# EAGLE design sch2 (EAGLE 7.6.0)
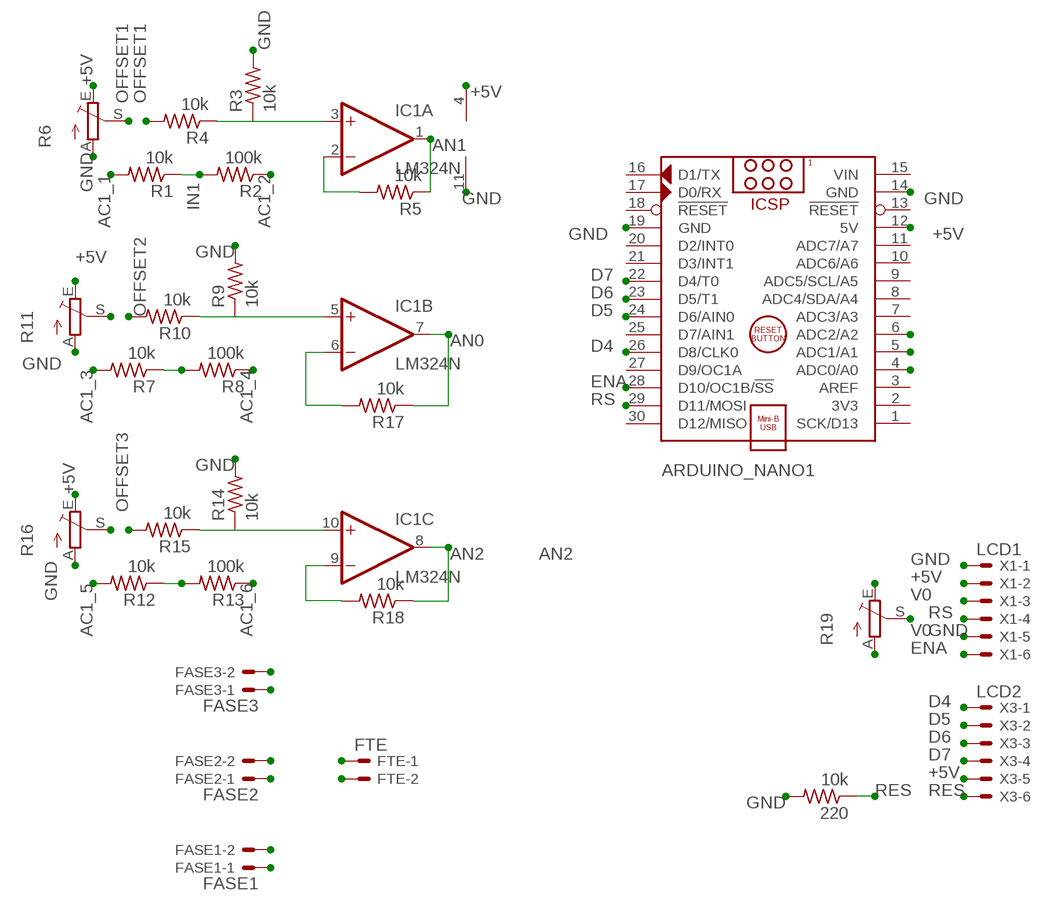
[diagram p0: schematic, sheet 1]

## Parts
220  10k  R-US_0204/7  [0204/7]
ARDUINO_NANO1  ARDUINO_NANO  [ARDUINO_NANO]
FASE1  FASE1  22-23-2021  [22-23-2021]
FASE2  FASE2  22-23-2021  [22-23-2021]
FASE3  FASE3  22-23-2021  [22-23-2021]
FTE  FTE  22-23-2021  [22-23-2021]
IC1  LM324N  [DIL14]
R1  10k  R-US_0204/7  [0204/7]
R2  100k  R-US_0204/7  [0204/7]
R3  10k  R-US_0204/7  [0204/7]
R4  10k  R-US_0204/7  [0204/7]
R5  10k  R-US_0204/7  [0204/7]
R6  TRIM_EU-B64Y  [B64Y]
R7  10k  R-US_0204/7  [0204/7]
R8  100k  R-US_0204/7  [0204/7]
R9  10k  R-US_0204/7  [0204/7]
R10  10k  R-US_0204/7  [0204/7]
R11  TRIM_EU-B64Y  [B64Y]
R12  10k  R-US_0204/7  [0204/7]
R13  100k  R-US_0204/7  [0204/7]
R14  10k  R-US_0204/7  [0204/7]
R15  10k  R-US_0204/7  [0204/7]
R16  TRIM_EU-B64Y  [B64Y]
R17  10k  R-US_0204/7  [0204/7]
R18  10k  R-US_0204/7  [0204/7]
R19  TRIM_EU-B64Y  [B64Y]
X1  LCD1  22-23-2061  [22-23-2061]
X3  LCD2  22-23-2061  [22-23-2061]

## Nets
+5V: ARDUINO_NANO1.12(5V) FTE.1 IC1.4(P:V+) R6.E R11.E R16.E R19.E X1.2 X3.5
AC1_1: FASE1.1 R1.2
AC1_2: FASE1.2 R2.1
AC1_3: FASE2.1 R7.2
AC1_4: FASE2.2 R8.1
AC1_5: FASE3.1 R12.2
AC1_6: FASE3.2 R13.1
AN0: ARDUINO_NANO1.4(ADC0/A0) IC1.7(B:OUT) R17.1
AN1: ARDUINO_NANO1.5(ADC1/A1) IC1.1(A:OUT) R5.1
AN2: ARDUINO_NANO1.6(ADC2/A2) IC1.8(C:OUT) R18.1
D4: ARDUINO_NANO1.26(D8/CLK0) X3.1
D5: ARDUINO_NANO1.24(D6/AIN0) X3.2
D6: ARDUINO_NANO1.23(D5/T1) X3.3
D7: ARDUINO_NANO1.22(D4/T0) X3.4
ENA: ARDUINO_NANO1.28(D10/OC1B/!SS) X1.6
GND: 220.2 ARDUINO_NANO1.14(GND) ARDUINO_NANO1.19(GND) FTE.2 IC1.11(P:V-) R3.2 R6.A R9.2 R11.A R14.2 R16.A R19.A X1.1 X1.5
IN1: IC1.3(A:+IN) R1.1 R2.2 R3.1 R4.1
IN2: IC1.5(B:+IN) R7.1 R8.2 R9.1 R10.1
IN3: IC1.10(C:+IN) R12.1 R13.2 R14.1 R15.1
N$1: IC1.9(C:-IN) R18.2
N$2: IC1.2(A:-IN) R5.2
N$5: IC1.6(B:-IN) R17.2
OFFSET1: R4.2 R6.S
OFFSET2: R10.2 R11.S
OFFSET3: R15.2 R16.S
RES: 220.1 X3.6
RS: ARDUINO_NANO1.29(D11/MOSI) X1.4
V0: R19.S X1.3
Unconnected: ARDUINO_NANO1.1(SCK/D13) ARDUINO_NANO1.2(3V3) ARDUINO_NANO1.3(AREF) ARDUINO_NANO1.7(ADC3/A3) ARDUINO_NANO1.8(ADC4/SDA/A4) ARDUINO_NANO1.9(ADC5/SCL/A5) ARDUINO_NANO1.10(ADC6/A6) ARDUINO_NANO1.11(ADC7/A7) ARDUINO_NANO1.13(!RESET) ARDUINO_NANO1.16(D1/TX) ARDUINO_NANO1.17(D0/RX) ARDUINO_NANO1.18(!RESET) ARDUINO_NANO1.20(D2/INT0) ARDUINO_NANO1.21(D3/INT1) ARDUINO_NANO1.25(D7/AIN1) ARDUINO_NANO1.27(D9/OC1A) ARDUINO_NANO1.30(D12/MISO) IC1.12(D:+IN) IC1.13(D:-IN) IC1.14(D:OUT)

## Power pins joined to a net without a drawn wire
VIN: ARDUINO_NANO1.15(VIN)

## Library data of the parts
220 R1-R5 R7-R10 R12-R15 R17 R18 = rcl:R-US_: RESISTOR, American symbol
ARDUINO_NANO1 = ArduinoNanoV30:ARDUINO_NANO: Arduino Nano V3.0 Module Overview: The Arduino Nano is a small, complete, and breadboard-friendly board based on the ATmega328 (Arduino Nano 3.x) or ATmega168 (Arduino Nano 2.x). It has more or less the same functionality of the Arduino Duemilanove, but in a different package. It lacks only a DC power jack, and works with a Mini-B USB cable instead of a standard one. The Nano was designed and is being produced by Gravitech <http://www.gravitech.us/arna30wiatp.html>. General specifications: Item Value Microcontroller Atmel ATmega168 or ATmega328 Operating Voltage (logic level) 5 V Input Voltage (recommended) 7-12 V Input Voltage (limits) 6-20 V Digital I/O Pins 14 (of which 6 provide PWM output) Analog Input Pins 8 DC Current per I/O Pin 40 mA Flash Memory 16 KB (ATmega168) or 32 KB (ATmega328) of which 2 KB used by bootloader SRAM 1 KB (ATmega168) or 2 KB (ATmega328) EEPROM 512 bytes (ATmega168) or 1 KB (ATmega328) Clock Speed 16 MHz Dimensions (Inches) 0.73" x 1.70" Dimensions (mm) 18mm x 45mm Overall height About 9 mm (not including pins) Weigth 5 g Power: The Arduino Nano can be powered via the Mini-B USB connection, 6-20V unregulated external power supply (pin 30), or 5V regulated external power supply (pin 27). The power source is automatically selected to the highest voltage source. Memory: The ATmega168 has 16 KB of flash memory for storing code (of which 2 KB is used for the bootloader); the ATmega328 has 32 KB, (also with 2 KB used for the bootloader). The ATmega168 has 1 KB of SRAM and 512 bytes of EEPROM (which can be read and written with the EEPROM library); the ATmega328 has 2 KB of SRAM and 1 KB of EEPROM. Input and Output: Each of the 14 digital pins on the Nano can be used as an input or output, using pinMode(), digitalWrite(), and digitalRead() functions. They operate at 5 volts. Each pin can provide or receive a maximum of 40 mA and has an internal pull-up resistor (disconnected by default) of 20-50 kOhms. In addition, some pins have specialized functions. Visit Arduino - ArduinoBoardNano <https://www.arduino.cc/en/Main/ArduinoBoardNano>
FASE1-FASE3 FTE = con-molex:22-23-2021: .100" (2.54mm) Center Header - 2 Pin; MF: MOLEX; MPN: 22-23-2021; OC_FARNELL: 1462926; OC_NEWARK: 25C3832
IC1 = linear:LM324: OP AMP
R6 R11 R16 R19 = pot:TRIM_EU-: POTENTIOMETER
X1 X3 = con-molex:22-23-2061: .100" (2.54mm) Center Header - 6 Pin; MF: MOLEX; MPN: 22-23-2061; OC_FARNELL: 1462922; OC_NEWARK: 27C1933

## Board
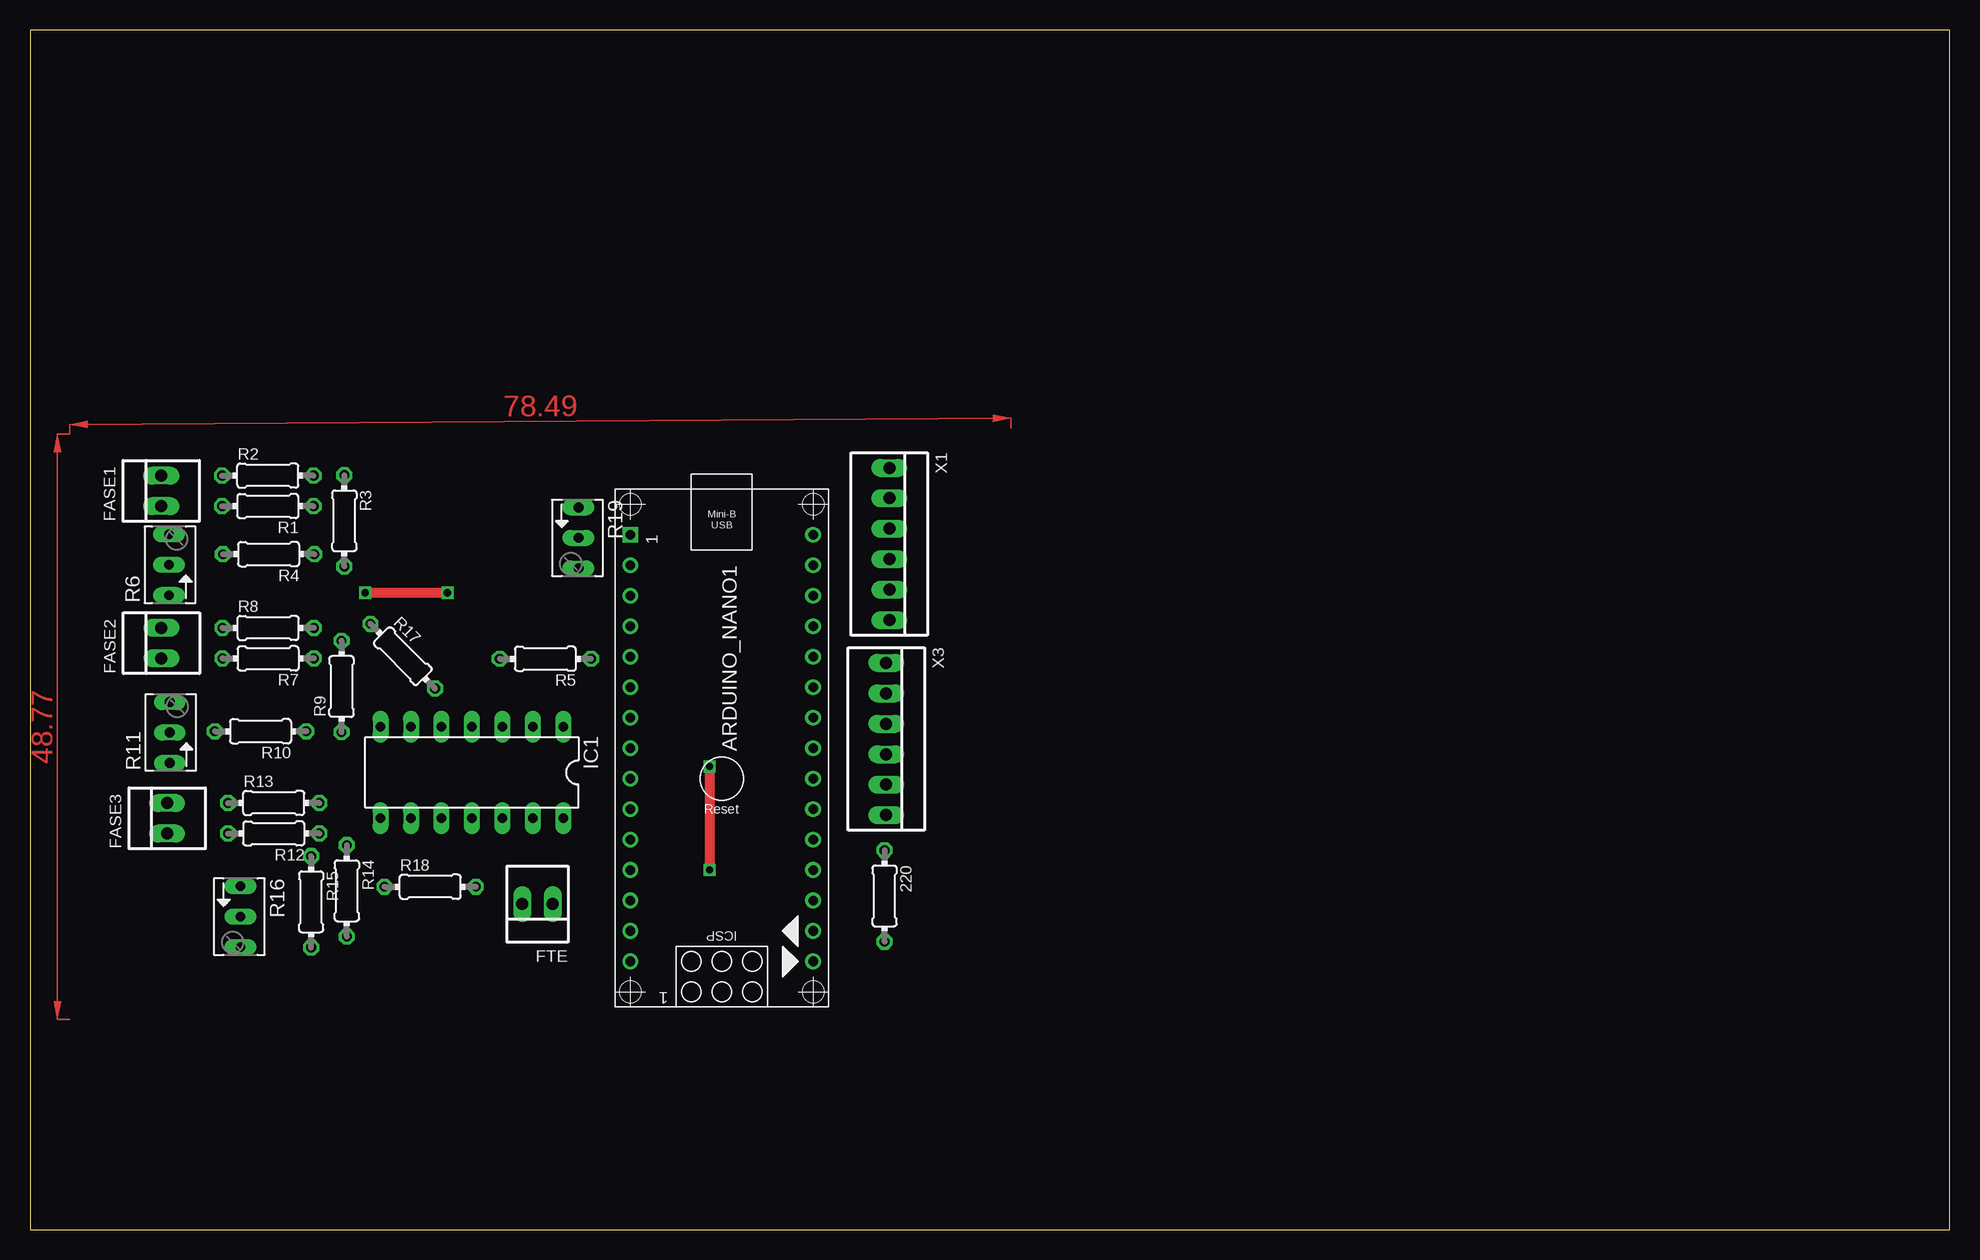
[diagram p1: board, top side]
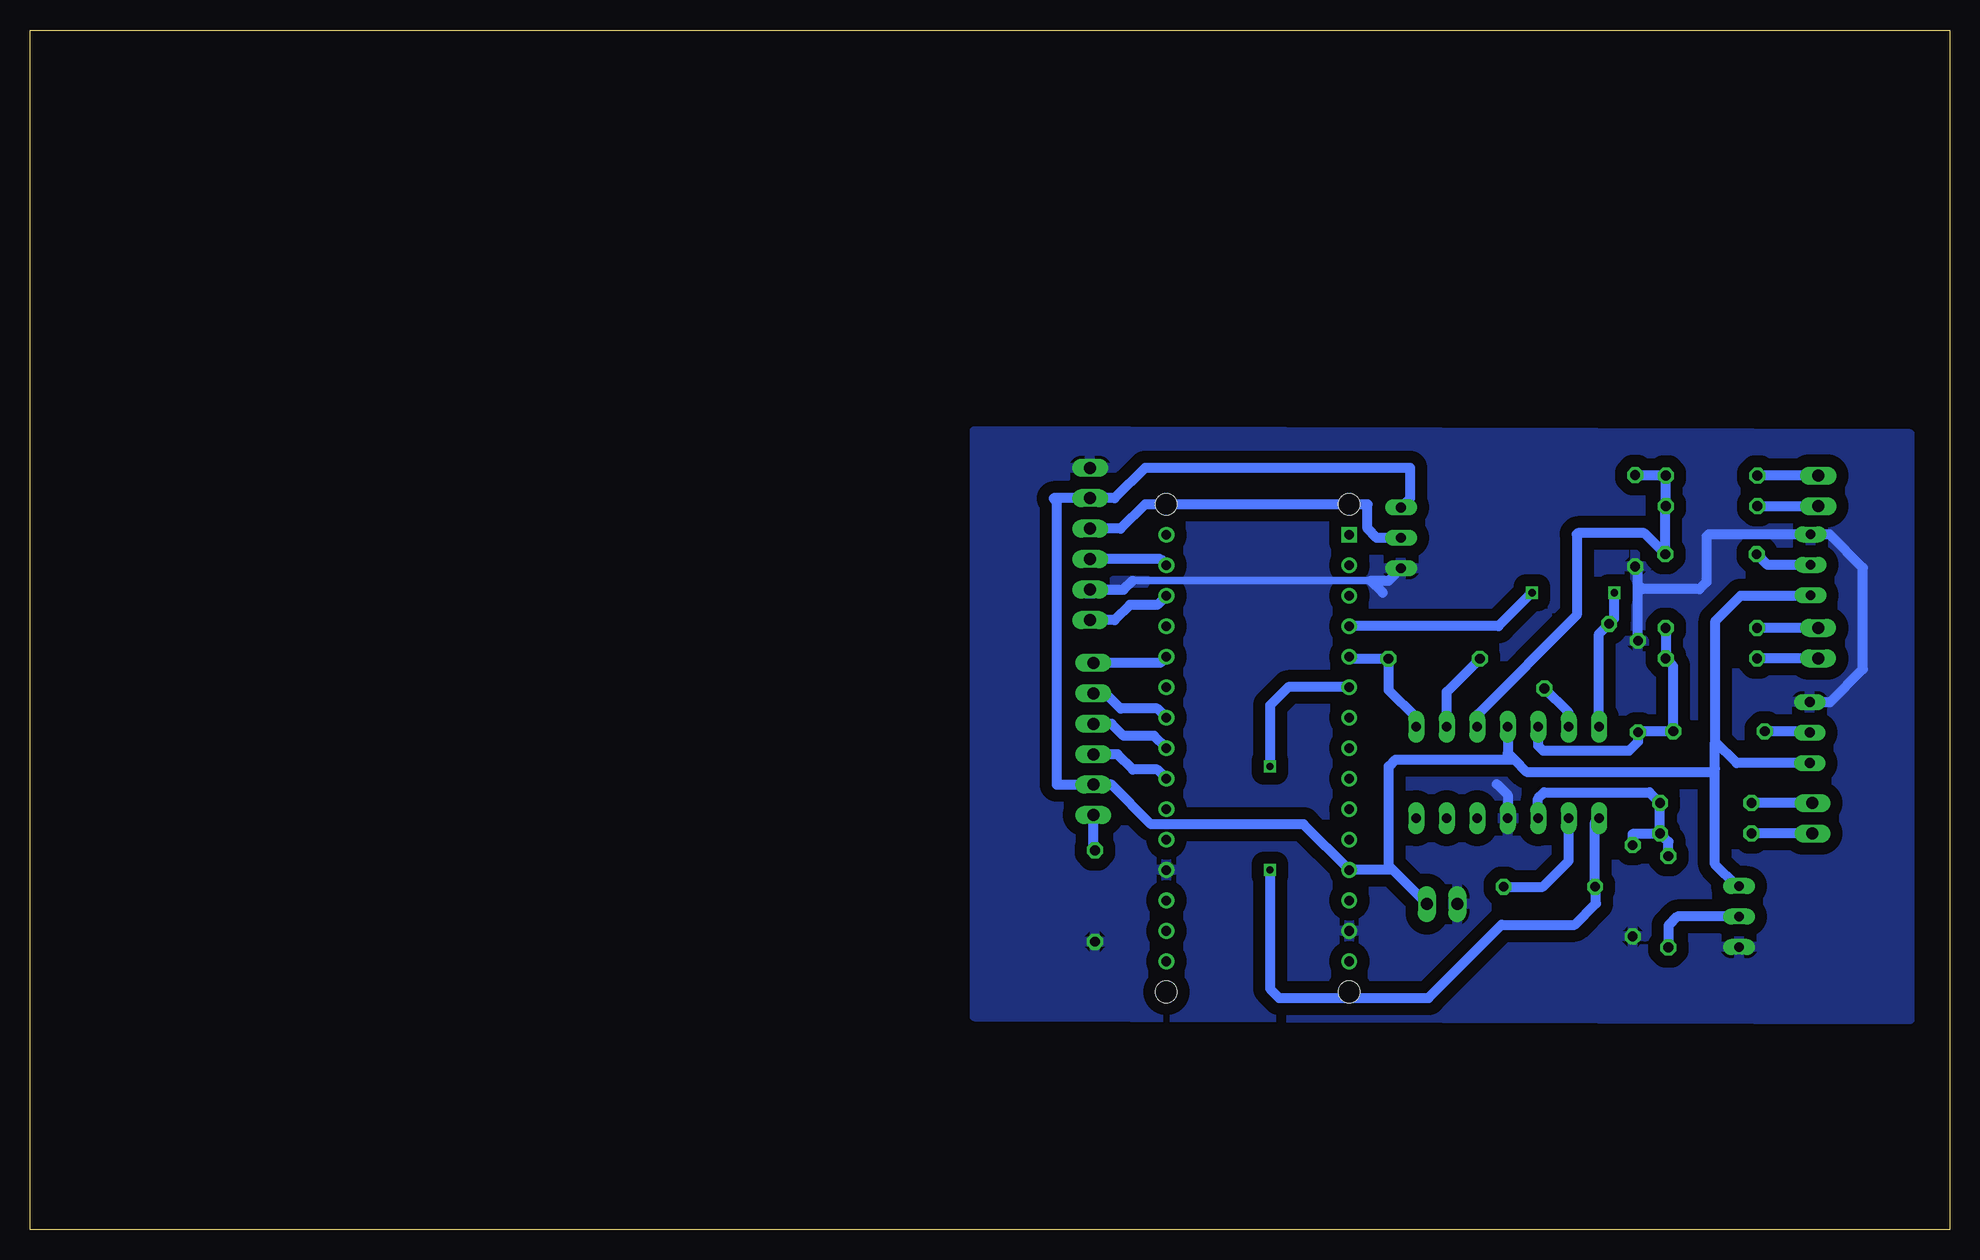
[diagram p2: board, bottom side, seen from below]

Size 160 x 100 mm. Coordinates in mm from the lower left corner, seen from the top.
Outline: 0,0 160,0 160,100 0,100 0,0
Copper layers (1*16): Top 0.035mm / dielectric 1.5mm / Bottom 0.035mm
Design rules "default": minimum track width 10mil, minimum drill 24mil, track to track 8mil, track to pad 8mil, pad to pad 8mil, via to via 8mil, smd to smd 8mil, copper to edge 40mil, drill to drill 8mil, minimum pad ring 10mil, minimum via ring 8mil, stop-mask expansion 4mil, vias tented up to drill 0mil, thermal gap 10mil

### Footprints (pad centres in the part's own frame; a part is rotated, then mirrored left to right if it is on the bottom)
0204/7 = drill 0.813 octagon: 1 -3.81,0; 2 3.81,0
ARDUINO_NANO = drill 0.8 square: 1 -20.32,-7.62 | drill 0.8: 2 -17.78,-7.62; 3 -15.24,-7.62; 4 -12.7,-7.62; 5 -10.16,-7.62; 6 -7.62,-7.62; 7 -5.08,-7.62; 8 -2.54,-7.62; 9 0,-7.62; 10 2.54,-7.62; 11 5.08,-7.62; 12 7.62,-7.62; 13 10.16,-7.62; 14 12.7,-7.62; 15 15.24,-7.62; 16 15.24,7.62; 17 12.7,7.62; 18 10.16,7.62; 19 7.62,7.62; 20 5.08,7.62; 21 2.54,7.62; 22 0,7.62; 23 -2.54,7.62; 24 -5.08,7.62; 25 -7.62,7.62; 26 -10.16,7.62; 27 -12.7,7.62; 28 -15.24,7.62; 29 -17.78,7.62; 30 -20.32,7.62 | hole 1.778: -22.86,-7.62; -22.86,7.62; 17.78,7.62; 17.78,-7.62
22-23-2021 = drill 1 long: 1 -1.27,0; 2 1.27,0
DIL14 = drill 0.813 long: 1 -7.62,-3.81; 2 -5.08,-3.81; 3 -2.54,-3.81; 4 0,-3.81; 5 2.54,-3.81; 6 5.08,-3.81; 7 7.62,-3.81; 8 7.62,3.81; 9 5.08,3.81; 10 2.54,3.81; 11 0,3.81; 12 -2.54,3.81; 13 -5.08,3.81; 14 -7.62,3.81
B64Y = drill 0.813 long: A 2.54,0; E -2.54,0; S 0,0
22-23-2061 = drill 1 long: 1 -6.35,0; 2 -3.81,0; 3 -1.27,0; 4 1.27,0; 5 3.81,0; 6 6.35,0

### Placement (x,y rotation side)
220  71.23,27.8 270 top
ARDUINO_NANO1  57.66,37.59 270 top
FASE1  10.94,61.58 90 top
FASE2  10.96,48.88 90 top
FASE3  11.43,34.29 90 top
FTE  42.3,27.13 180 top
IC1  36.83,38.1 180 top
R1  19.83,60.31 180 top
R2  19.83,62.85 0 top
R3  26.2,59.08 270 top
R4  19.88,56.3 180 top
R5  42.96,47.58 180 top
R6  11.58,55.42 90 top
R7  19.85,47.61 180 top
R8  19.85,50.15 0 top
R9  25.97,45.27 90 top
R10  19.22,41.53 180 top
R11  11.64,41.43 90 top
R12  20.32,33.02 180 top
R13  20.32,35.56 0 top
R14  26.41,28.24 270 top
R15  23.44,27.32 270 top
R16  17.54,26.09 270 top
R17  31.07,47.8 315 top
R18  33.36,28.58 0 top
R19  45.72,57.66 270 top
X1  71.63,57.15 270 top
X3  71.37,40.89 270 top

### Tracks (layer width: path | path; a pad name or v marks a point on that pad's centre or on a via)
+5V
  Bottom 0.813: R11.E 17.75,38.89 19.51,40.66 | 19.51,40.66 19.51,50.74 17.4,52.85 11.61,52.85 R6.E | R16.E 17.74,28.63 19.56,30.45 19.56,38.43 | 19.56,38.43 19.56,40.6 19.51,40.66 | IC1.4 36.83,39.73 36.27,39.17 | 36.27,39.17 35.26,38.16 19.84,38.16 19.56,38.43 | FTE.1 46.42,29.97 | 46.42,29.97 ARDUINO_NANO1.12 53.85,33.78 66.55,33.78 69.85,37.08 X3.5 74.42,37.08 74.42,60.71 74.68,60.96 X1.2 69.6,60.96 67.06,63.5 44.96,63.5 44.96,60.96 R19.E | 46.42,29.97 46.74,30.29 46.74,38.61 46.18,39.17 36.27,39.17
AC1_1
  Bottom 0.813: FASE1.1 11.16,60.31 11.18,60.28 15.99,60.28 R1.2
AC1_2
  Bottom 0.813: FASE1.2 R2.1
AC1_3
  Bottom 0.813: FASE2.1 R7.2
AC1_4
  Bottom 0.813: FASE2.2 R8.1
AC1_5
  Bottom 0.813: FASE3.1 R12.2
AC1_6
  Bottom 0.813: FASE3.2 R13.1
AN0  (via drill 0.6)
  Top 0.813: v27.94,53.09 v34.8,53.09
  Bottom 0.813: IC1.7 29.21,49.66 R17.1 27.94,50.93 v27.94,53.09 | v34.8,53.09 37.59,50.29 ARDUINO_NANO1.4
AN1
  Bottom 0.813: IC1.1 44.45,42.67 46.74,44.96 46.74,47.55 R5.1 49.87,47.58 ARDUINO_NANO1.5
AN2  (via drill 0.6)
  Top 0.813: v56.64,38.61 v56.64,29.97
  Bottom 0.813: ARDUINO_NANO1.6 55.12,45.21 56.64,43.69 v56.64,38.61 | v56.64,29.97 56.64,20.07 55.88,19.3 43.43,19.3 37.34,25.4 31.24,25.4 29.46,27.18 29.46,28.49 R18.1 29.55,33.95 IC1.8
D4
  Bottom 0.813: ARDUINO_NANO1.26 65.79,47.24 X3.1
D5
  Bottom 0.813: ARDUINO_NANO1.24 66.04,43.43 69.09,43.43 70.36,44.7 X3.2
D6
  Bottom 0.813: ARDUINO_NANO1.23 66.29,41.15 68.83,41.15 69.85,42.16 X3.3
D7
  Bottom 0.813: ARDUINO_NANO1.22 66.04,38.35 68.07,38.35 69.34,39.62 X3.4
ENA
  Bottom 0.813: ARDUINO_NANO1.28 66.04,52.07 68.33,52.07 69.6,50.8 X1.6
GND
  Bottom 0.61: 68.07,54.1 48.26,54.1
  Bottom 0.813: R11.A 9.95,43.97 7.21,46.71 7.21,55.15 10,57.94 11.57,57.94 R6.A 20.1,57.95 20.27,57.78 20.27,53.97 20.84,53.39 25.58,53.39 25.97,53.78 | R9.2 25.97,53.78 | 25.97,53.78 25.97,55.04 R3.2 26.24,55.23 | 37.74,37.13 36.83,36.22 IC1.11 | X1.5 68.83,53.34 68.07,54.1 | 47.24,53.09 48.26,54.1 46.74,54.1 R19.A
  pour Bottom (isolate 1.016): 3.3,66.29 81.28,66.55 81.28,17.78 3.3,17.53
IN1
  Bottom 0.813: R3.1 26.16,62.85 R2.2 R1.1 23.69,60.25 R4.1 25.45,58.05 30.99,58.05 31.07,57.98 31.07,51.22 39.37,42.92 IC1.3
IN2
  Bottom 0.813: R8.2 R7.1 23.02,46.98 R10.1 25.89,41.53 R9.1 25.97,40.66 26.72,39.91 33.86,39.91 34.28,40.33 IC1.5 34.16,41.78
IN3
  Bottom 0.813: R12.1 R13.2 25.02,36.45 33.79,36.45 34.3,35.93 34.3,34.3 IC1.10 | R14.1 26.41,32.95 26.34,33.02 R12.1 | R15.1 23.44,32.33 R12.1
N$1
  Bottom 0.813: R18.2 33.91,28.57 31.75,30.73 IC1.9
N$2
  Bottom 0.813: IC1.2 41.91,44.82 R5.2
N$5
  Bottom 0.813: IC1.6 31.75,43.09 R17.2
OFFSET1
  Bottom 0.813: R6.S 15.19,55.41 R4.2
OFFSET2
  Bottom 0.813: R11.S 11.74,41.53 R10.2
OFFSET3
  Bottom 0.813: R16.S 22.67,26.09 23.42,25.33 23.42,23.52 R15.2
RES
  Bottom 0.813: 220.1 71.37,31.76 X3.6
RS
  Bottom 0.813: ARDUINO_NANO1.29 65.79,55.88 X1.4
V0
  Bottom 0.813: X1.3 69.09,58.42 67.06,60.45 48.51,60.45 48.51,58.42 47.75,57.66 R19.S
(copper drawn outside any net)
  shapes: Top area x2